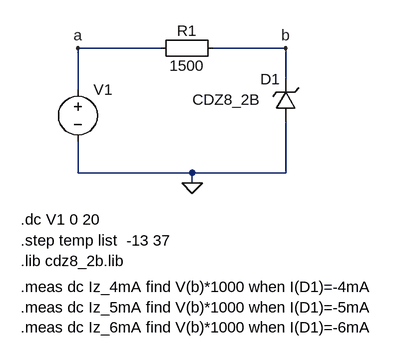
[diagram p0: schematic VA-R2.asc]
VA-R2.asc, the LTspice schematic file:
Version 4
SHEET 1 880 680
WIRE 96 -288 -32 -288
WIRE 288 -288 176 -288
WIRE 288 -240 288 -288
WIRE -32 -224 -32 -288
WIRE -32 -96 -32 -144
WIRE 144 -96 -32 -96
WIRE 288 -96 288 -176
WIRE 288 -96 144 -96
WIRE 144 -80 144 -96
FLAG 144 -80 0
FLAG 288 -288 b
FLAG -32 -288 a
SYMBOL Misc\\EuropeanResistor 192 -304 R90
WINDOW 0 5 56 VBottom 2
WINDOW 3 27 56 VTop 2
SYMATTR InstName R1
SYMATTR Value 1500
SYMBOL voltage -32 -240 R0
WINDOW 3 24 96 Invisible 2
SYMATTR Value ""
SYMATTR InstName V1
SYMBOL zener 304 -176 R180
WINDOW 0 24 64 Left 2
WINDOW 3 54 33 Left 2
SYMATTR InstName D1
SYMATTR Value CDZ8_2B
TEXT -120 -24 Left 2 !.dc V1 0 20
TEXT -120 8 Left 2 !.step temp list  -13 37
TEXT -120 40 Left 2 !.lib cdz8_2b.lib
TEXT -120 80 Left 2 !.meas dc Iz_4mA find V(b)*1000 when I(D1)=-4mA\n.meas dc Iz_5mA find V(b)*1000 when I(D1)=-5mA\n.meas dc Iz_6mA find V(b)*1000 when I(D1)=-6mA

The netlist it stands for:
* VA-R2.asc
R1 b a 1500
V1 a 0
D1 0 b CDZ8_2B
.model D D
.lib standard.dio
.dc V1 0 20
.step temp list  -13 37
.lib cdz8_2b.lib
.meas dc Iz_4mA find V(b)*1000 when I(D1)=-4mA
.meas dc Iz_5mA find V(b)*1000 when I(D1)=-5mA
.meas dc Iz_6mA find V(b)*1000 when I(D1)=-6mA
.backanno
.end